# Altium project GEM_AFE_128.PrjPcb (part 2 of 4)

## Sheet DAC.SchDoc: DAC
size 420 x 297 mm; CheckedBy: K.Belewicz; DrawnBy: G.Kasprowicz; SheetNumber: 3; SheetTotal: 5; ModifiedBy: -; CheckedDate: 12.06.2022; Title2: GEM AFE 128; DivGrp: WUT ISE; Designer: G.Kasprowicz
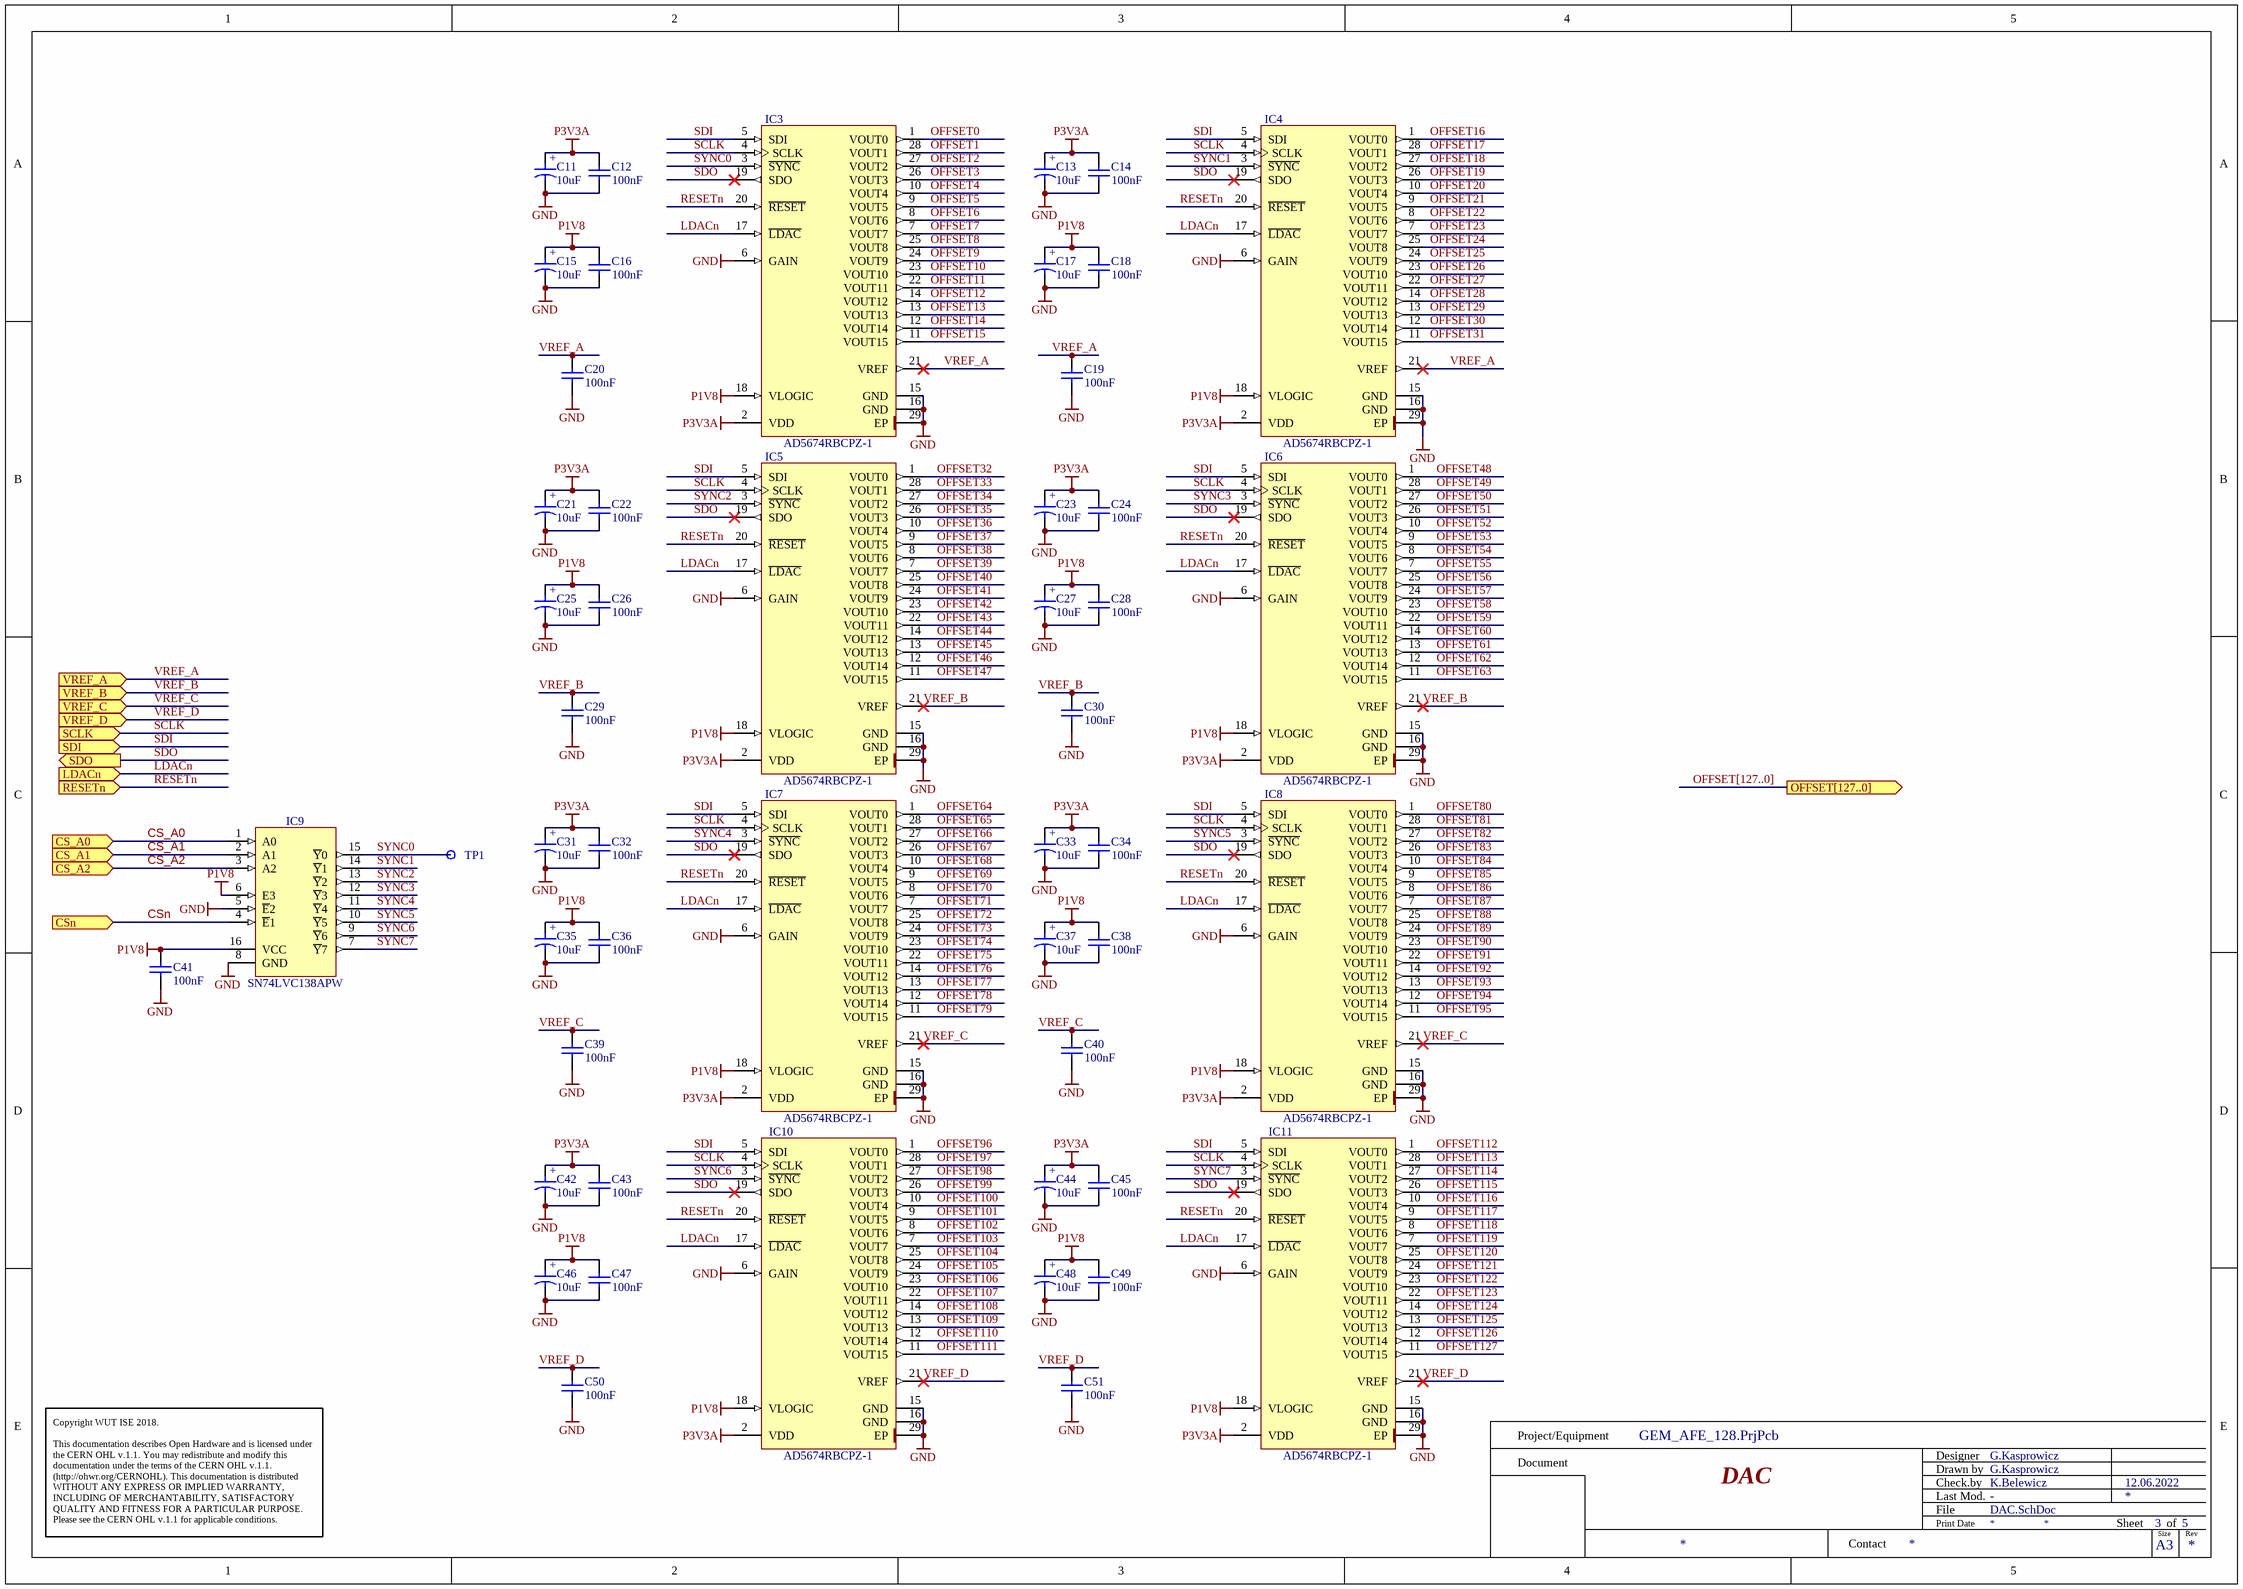
[diagram p2: DAC.SchDoc]

### Parts
C11  10uF  [CAPMP3216X180N]
C12  100nF  [CAPC1005X55N]
C13  10uF  [CAPMP3216X180N]
C14  100nF  [CAPC1005X55N]
C15  10uF  [CAPMP3216X180N]
C16  100nF  [CAPC1005X55N]
C17  10uF  [CAPMP3216X180N]
C18  100nF  [CAPC1005X55N]
C19  100nF  [CAPC1005X55N]
C20  100nF  [CAPC1005X55N]
C21  10uF  [CAPMP3216X180N]
C22  100nF  [CAPC1005X55N]
C23  10uF  [CAPMP3216X180N]
C24  100nF  [CAPC1005X55N]
C25  10uF  [CAPMP3216X180N]
C26  100nF  [CAPC1005X55N]
C27  10uF  [CAPMP3216X180N]
C28  100nF  [CAPC1005X55N]
C29  100nF  [CAPC1005X55N]
C30  100nF  [CAPC1005X55N]
C31  10uF  [CAPMP3216X180N]
C32  100nF  [CAPC1005X55N]
C33  10uF  [CAPMP3216X180N]
C34  100nF  [CAPC1005X55N]
C35  10uF  [CAPMP3216X180N]
C36  100nF  [CAPC1005X55N]
C37  10uF  [CAPMP3216X180N]
C38  100nF  [CAPC1005X55N]
C39  100nF  [CAPC1005X55N]
C40  100nF  [CAPC1005X55N]
C41  100nF  [CAPC1005X55N]
C42  10uF  [CAPMP3216X180N]
C43  100nF  [CAPC1005X55N]
C44  10uF  [CAPMP3216X180N]
C45  100nF  [CAPC1005X55N]
C46  10uF  [CAPMP3216X180N]
C47  100nF  [CAPC1005X55N]
C48  10uF  [CAPMP3216X180N]
C49  100nF  [CAPC1005X55N]
C50  100nF  [CAPC1005X55N]
C51  100nF  [CAPC1005X55N]
IC3  AD5674RBCPZ-1  [QFN40P400X400X100-29N-S270]
IC4  AD5674RBCPZ-1  [QFN40P400X400X100-29N-S270]
IC5  AD5674RBCPZ-1  [QFN40P400X400X100-29N-S270]
IC6  AD5674RBCPZ-1  [QFN40P400X400X100-29N-S270]
IC7  AD5674RBCPZ-1  [QFN40P400X400X100-29N-S270]
IC8  AD5674RBCPZ-1  [QFN40P400X400X100-29N-S270]
IC9  SN74LVC138APW  [SOP65P640X110-16N]
IC10  AD5674RBCPZ-1  [QFN40P400X400X100-29N-S270]
IC11  AD5674RBCPZ-1  [QFN40P400X400X100-29N-S270]
TP1  Test Point  [TPS127]  (value not drawn)

### Ports
CS_A0 (in), CS_A1 (in), CS_A2 (in), CSn (in), LDACn (in), OFFSET[127..0] (out), RESETn (in), SCLK (in), SDI (in), SDO (out), VREF_A (in), VREF_B (in), VREF_C (in), VREF_D (in)

### Nets
GND: C11.2 C12.1 C13.2 C14.1 C15.2 C16.1 C17.2 C18.1 C19.1 C20.1 C21.2 C22.1 C23.2 C24.1 C25.2 C26.1 C27.2 C28.1 C29.1 C30.1 C31.2 C32.1 C33.2 C34.1 C35.2 C36.1 C37.2 C38.1 C39.1 C40.1 C41.1 C42.2 C43.1 C44.2 C45.1 C46.2 C47.1 C48.2 C49.1 C50.1 C51.1 IC3.6(GAIN) IC3.15(GND) IC3.16(GND) IC3.29(EP) IC4.6(GAIN) IC4.15(GND) IC4.16(GND) IC4.29(EP) IC5.6(GAIN) IC5.15(GND) IC5.16(GND) IC5.29(EP) IC6.6(GAIN) IC6.15(GND) IC6.16(GND) IC6.29(EP) IC7.6(GAIN) IC7.15(GND) IC7.16(GND) IC7.29(EP) IC8.6(GAIN) IC8.15(GND) IC8.16(GND) IC8.29(EP) IC9.5(~{E}2) IC9.8(GND) IC10.6(GAIN) IC10.15(GND) IC10.16(GND) IC10.29(EP) IC11.6(GAIN) IC11.15(GND) IC11.16(GND) IC11.29(EP)
P1V8: C15.1 C16.2 C17.1 C18.2 C25.1 C26.2 C27.1 C28.2 C35.1 C36.2 C37.1 C38.2 C41.2 C46.1 C47.2 C48.1 C49.2 IC3.18(VLOGIC) IC4.18(VLOGIC) IC5.18(VLOGIC) IC6.18(VLOGIC) IC7.18(VLOGIC) IC8.18(VLOGIC) IC9.6(E3) IC9.16(VCC) IC10.18(VLOGIC) IC11.18(VLOGIC)
P3V3A: C11.1 C12.2 C13.1 C14.2 C21.1 C22.2 C23.1 C24.2 C31.1 C32.2 C33.1 C34.2 C42.1 C43.2 C44.1 C45.2 IC3.2(VDD) IC4.2(VDD) IC5.2(VDD) IC6.2(VDD) IC7.2(VDD) IC8.2(VDD) IC10.2(VDD) IC11.2(VDD)
CS_A0: IC9.1(A0) ; port CS_A0
CS_A1: IC9.2(A1) ; port CS_A1
CS_A2: IC9.3(A2) ; port CS_A2
CSn: IC9.4(~{E}1) ; port CSn
LDACn: IC3.17(~{LDAC}) IC4.17(~{LDAC}) IC5.17(~{LDAC}) IC6.17(~{LDAC}) IC7.17(~{LDAC}) IC8.17(~{LDAC}) IC10.17(~{LDAC}) IC11.17(~{LDAC}) ; port LDACn  [project net DAC_LDACn]
OFFSET0: IC3.1(VOUT0)
OFFSET1: IC3.28(VOUT1)
OFFSET2: IC3.27(VOUT2)
OFFSET3: IC3.26(VOUT3)
OFFSET4: IC3.10(VOUT4)
OFFSET5: IC3.9(VOUT5)
OFFSET6: IC3.8(VOUT6)
OFFSET7: IC3.7(VOUT7)
OFFSET8: IC3.25(VOUT8)
OFFSET9: IC3.24(VOUT9)
OFFSET10: IC3.23(VOUT10)
OFFSET11: IC3.22(VOUT11)
OFFSET12: IC3.14(VOUT12)
OFFSET13: IC3.13(VOUT13)
OFFSET14: IC3.12(VOUT14)
OFFSET15: IC3.11(VOUT15)
OFFSET16: IC4.1(VOUT0)
OFFSET17: IC4.28(VOUT1)
OFFSET18: IC4.27(VOUT2)
OFFSET19: IC4.26(VOUT3)
OFFSET20: IC4.10(VOUT4)
OFFSET21: IC4.9(VOUT5)
OFFSET22: IC4.8(VOUT6)
OFFSET23: IC4.7(VOUT7)
OFFSET24: IC4.25(VOUT8)
OFFSET25: IC4.24(VOUT9)
OFFSET26: IC4.23(VOUT10)
OFFSET27: IC4.22(VOUT11)
OFFSET28: IC4.14(VOUT12)
OFFSET29: IC4.13(VOUT13)
OFFSET30: IC4.12(VOUT14)
OFFSET31: IC4.11(VOUT15)
OFFSET32: IC5.1(VOUT0)
OFFSET33: IC5.28(VOUT1)
OFFSET34: IC5.27(VOUT2)
OFFSET35: IC5.26(VOUT3)
OFFSET36: IC5.10(VOUT4)
OFFSET37: IC5.9(VOUT5)
OFFSET38: IC5.8(VOUT6)
OFFSET39: IC5.7(VOUT7)
OFFSET40: IC5.25(VOUT8)
OFFSET41: IC5.24(VOUT9)
OFFSET42: IC5.23(VOUT10)
OFFSET43: IC5.22(VOUT11)
OFFSET44: IC5.14(VOUT12)
OFFSET45: IC5.13(VOUT13)
OFFSET46: IC5.12(VOUT14)
OFFSET47: IC5.11(VOUT15)
OFFSET48: IC6.1(VOUT0)
OFFSET49: IC6.28(VOUT1)
OFFSET50: IC6.27(VOUT2)
OFFSET51: IC6.26(VOUT3)
OFFSET52: IC6.10(VOUT4)
OFFSET53: IC6.9(VOUT5)
OFFSET54: IC6.8(VOUT6)
OFFSET55: IC6.7(VOUT7)
OFFSET56: IC6.25(VOUT8)
OFFSET57: IC6.24(VOUT9)
OFFSET58: IC6.23(VOUT10)
OFFSET59: IC6.22(VOUT11)
OFFSET60: IC6.14(VOUT12)
OFFSET61: IC6.13(VOUT13)
OFFSET62: IC6.12(VOUT14)
OFFSET63: IC6.11(VOUT15)
OFFSET64: IC7.1(VOUT0)
OFFSET65: IC7.28(VOUT1)
OFFSET66: IC7.27(VOUT2)
OFFSET67: IC7.26(VOUT3)
OFFSET68: IC7.10(VOUT4)
OFFSET69: IC7.9(VOUT5)
OFFSET70: IC7.8(VOUT6)
OFFSET71: IC7.7(VOUT7)
OFFSET72: IC7.25(VOUT8)
OFFSET73: IC7.24(VOUT9)
OFFSET74: IC7.23(VOUT10)
OFFSET75: IC7.22(VOUT11)
OFFSET76: IC7.14(VOUT12)
OFFSET77: IC7.13(VOUT13)
OFFSET78: IC7.12(VOUT14)
OFFSET79: IC7.11(VOUT15)
OFFSET80: IC8.1(VOUT0)
OFFSET81: IC8.28(VOUT1)
OFFSET82: IC8.27(VOUT2)
OFFSET83: IC8.26(VOUT3)
OFFSET84: IC8.10(VOUT4)
OFFSET85: IC8.9(VOUT5)
OFFSET86: IC8.8(VOUT6)
OFFSET87: IC8.7(VOUT7)
OFFSET88: IC8.25(VOUT8)
OFFSET89: IC8.24(VOUT9)
OFFSET90: IC8.23(VOUT10)
OFFSET91: IC8.22(VOUT11)
OFFSET92: IC8.14(VOUT12)
OFFSET93: IC8.13(VOUT13)
OFFSET94: IC8.12(VOUT14)
OFFSET95: IC8.11(VOUT15)
OFFSET96: IC10.1(VOUT0)
OFFSET97: IC10.28(VOUT1)
OFFSET98: IC10.27(VOUT2)
OFFSET99: IC10.26(VOUT3)
OFFSET100: IC10.10(VOUT4)
OFFSET101: IC10.9(VOUT5)
OFFSET102: IC10.8(VOUT6)
OFFSET103: IC10.7(VOUT7)
OFFSET104: IC10.25(VOUT8)
OFFSET105: IC10.24(VOUT9)
OFFSET106: IC10.23(VOUT10)
OFFSET107: IC10.22(VOUT11)
OFFSET108: IC10.14(VOUT12)
OFFSET109: IC10.13(VOUT13)
OFFSET110: IC10.12(VOUT14)
OFFSET111: IC10.11(VOUT15)
OFFSET112: IC11.1(VOUT0)
OFFSET113: IC11.28(VOUT1)
OFFSET114: IC11.27(VOUT2)
OFFSET115: IC11.26(VOUT3)
OFFSET116: IC11.10(VOUT4)
OFFSET117: IC11.9(VOUT5)
OFFSET118: IC11.8(VOUT6)
OFFSET119: IC11.7(VOUT7)
OFFSET120: IC11.25(VOUT8)
OFFSET121: IC11.24(VOUT9)
OFFSET122: IC11.23(VOUT10)
OFFSET123: IC11.22(VOUT11)
OFFSET124: IC11.14(VOUT12)
OFFSET125: IC11.13(VOUT13)
OFFSET126: IC11.12(VOUT14)
OFFSET127: IC11.11(VOUT15)
RESETn: IC3.20(~{RESET}) IC4.20(~{RESET}) IC5.20(~{RESET}) IC6.20(~{RESET}) IC7.20(~{RESET}) IC8.20(~{RESET}) IC10.20(~{RESET}) IC11.20(~{RESET}) ; port RESETn  [project net DAC_RESETn]
SCLK: IC3.4(SCLK) IC4.4(SCLK) IC5.4(SCLK) IC6.4(SCLK) IC7.4(SCLK) IC8.4(SCLK) IC10.4(SCLK) IC11.4(SCLK) ; port SCLK  [project net DAC_SCLK]
SDI: IC3.5(SDI) IC4.5(SDI) IC5.5(SDI) IC6.5(SDI) IC7.5(SDI) IC8.5(SDI) IC10.5(SDI) IC11.5(SDI) ; port SDI  [project net DAC_SDI]
SDO: IC3.19(SDO) IC4.19(SDO) IC5.19(SDO) IC6.19(SDO) IC7.19(SDO) IC8.19(SDO) IC10.19(SDO) IC11.19(SDO) ; port SDO  [project net DAC_SDO]
SYNC0: IC3.3(~{SYNC}) IC9.15(~{Y}0) TP1.1
SYNC1: IC4.3(~{SYNC}) IC9.14(~{Y}1)
SYNC2: IC5.3(~{SYNC}) IC9.13(~{Y}2)
SYNC3: IC6.3(~{SYNC}) IC9.12(~{Y}3)
SYNC4: IC7.3(~{SYNC}) IC9.11(~{Y}4)
SYNC5: IC8.3(~{SYNC}) IC9.10(~{Y}5)
SYNC6: IC9.9(~{Y}6) IC10.3(~{SYNC})
SYNC7: IC9.7(~{Y}7) IC11.3(~{SYNC})
VREF_A: C19.2 C20.2 IC3.21(VREF) IC4.21(VREF) ; port VREF_A
VREF_B: C29.2 C30.2 IC5.21(VREF) IC6.21(VREF) ; port VREF_B
VREF_C: C39.2 C40.2 IC7.21(VREF) IC8.21(VREF) ; port VREF_C
VREF_D: C50.2 C51.2 IC10.21(VREF) IC11.21(VREF) ; port VREF_D

### Buses and harness runs
bus OFFSET[127..0] = port OFFSET[127..0]

### Notes on the sheet
- Project/Equipment
- Document
- Designer
- Drawn by
- Check.by
- Copyright WUT ISE 2018.
  This documentation describes Open Hardware and is licensed under the CERN OHL v.1.1. You may redistribute and modify this documentation under the terms of the CERN OHL v.1.1. (http://ohwr.org/CERNOHL). This documentation is distributed WITHOUT ANY EXPRESS OR IMPLIED WARRANTY, INCLUDING OF MERCHANTABILITY, SATISFACTORY QUALITY AND FITNESS FOR A PARTICULAR PURPOSE. Please see the CERN OHL v.1.1 for applicable conditions.
- Contact
- File
- Last Mod.
- Print Date
- Sheet
- Size
- A3
- of
- Rev
- (in symbol CTE3216-18_10UF_16V_20%_AVX_TCJ) +

### Library data of the parts
C11 C13 C15 C17 C21 C23 C25 C27 C31 C33 C35 C37 C42 C44 C46 C48 = CTE3216-18_10UF_16V_20%_AVX_TCJ: Polarised capacitor; Part Description: ESR 0R200 Tantalum Solid Electrolytic Chip Capacitor with Conductive Polymer Electrode; Manufacturer: AVX; Manufacturer Part Number: TCJA106M016R0200; Voltage: 16V; Tolerance: ±20%; Part Number: CTE3216-18_10UF_16V_20%_AVX_TCJ; Component Kind: Standard; Component Type: Standard; Pin Count: 2; Value: 10uF; Status: Preferred; Case: A; Mounted: Yes; Socket: No; SMD: Yes; Sense: No; ComponentHeight: 1.8mm; HelpURL: \\cern.ch\dfs\Applications\Altium\Datasheets\CTE_AVX_TCJ.pdf; Author: CERN DEM JLC; CreateDate: 29.03.2012; LatestRevisionDate: 29.03.2012
C12 C14 C16 C18-C20 C22 C24 C26 C28-C30 C32 C34 C36 C38-C40 C43 C45 C47 C49-C51 = CC0402_100NF_6.3V_10%_X7R: Non-polarised capacitor; Part Description: SMD Multilayer Chip Ceramic Capacitor; Manufacturer: GENERIC; Manufacturer1 Part Number: GRM155R70J104KA01D; Voltage: 6.3V; TC: X7R; Tolerance: ±10%; Part Number: CC0402_100NF_6.3V_10%_X7R; Component Kind: Standard; Component Type: Standard; Pin Count: 2; Value: 100nF; Status: Not Recommended; Manufacturer Part Number: CC0402_100NF_6.3V_10%_X7R; Case: 0402; Mounted: Yes; Socket: No; SMD: Yes; Sense: No; Manufacturer1 Example: MURATA; Manufacturer1 ComponentHeight: 0.55mm; HelpURL: \\cern.ch\dfs\Applications\Altium\Datasheets\CC0402_X7R_MURATA_GRM.pdf; Author: CERN DEM BC; CreateDate: 02.11.2015; LatestRevisionDate: 02.11.2015
C41 = CC0402_100NF_16V_10%_X5R: Non-polarised capacitor; Part Description: SMD Multilayer Chip Ceramic Capacitor; Manufacturer: GENERIC; Manufacturer1 Part Number: GRM155R61C104KA88D; Voltage: 16V; TC: X5R; Tolerance: ±10%; Part Number: CC0402_100NF_16V_10%_X5R; Component Kind: Standard; Component Type: Standard; Pin Count: 2; Value: 100nF; Status: None; Manufacturer Part Number: CC0402_100NF_16V_10%_X5R; Case: 0402; Mounted: Yes; Socket: No; SMD: Yes; Sense: No; Manufacturer1 Example: MURATA; Manufacturer1 ComponentHeight: 0.55mm; HelpURL: \\cern.ch\dfs\Applications\Altium\Datasheets\CC0402_X5R_MURATA_GRM.pdf; Author: CERN DEM JLC; CreateDate: 10.12.2013; LatestRevisionDate: 10.12.2013
IC3-IC8 IC10 IC11 = AD5674RBCPZ-1: 12-Bit nanoDAC+ with 2 ppm/°C Voltage Reference Temperature Coefficient, SPI Interface; Manufacturer: ANALOG DEVICES; PressFit: No; Bonding: No; Part Number: AD5674RBCPZ-1; Component Kind: Standard; Component Type: Standard; Device: AD5674RBCPZ-1; PackageDescription: QFN, 0.40mm Pitch, Square; 28 Pin, 4.00mm L X 4.00mm W X 1.00mm H body (w/Thermal Tab 2.70 X 2.70mm), IPC Medium Density; Part Description: 12-Bit nanoDAC+ with 2 ppm/°C Voltage Reference Temperature Coefficient, SPI Interface; Manufacturer Part Number: AD5674RBCPZ-1; Pin Count: 28; Case: QFN28; Mounted: Yes; Socket: No; SMD: Yes; Sense: No; ComponentHeight: 1.0mm; Author: CERN DEM HF; HelpURL: \\cern.ch\dfs\Applications\Altium\Datasheets\AD5674RBCPZ-1.pdf; CreateDate: 19.04.2022; LatestRevisionDate: 19.04.2022
IC9 = SN74LVC138APW: 3-Line to 8-Line Decoder/Demultiplexer; Part Description: 3-Line to 8-Line Decoder/Demultiplexer, Inverting; Manufacturer: Texas Instruments; PressFit: No; Bonding: No; Part Number: SN74LVC138APW; Component Kind: Standard; Component Type: Standard; Device: SN74LVC138APW; PackageDescription: SOP, 0.65mm pitch; 16 pin, 4.40mm W X 5.00mm L X 1.10mm H body IPC Medium Density; Manufacturer Part Number: SN74LVC138APW; Pin Count: 16; Case: TSSOP16; Mounted: Yes; Socket: No; SMD: Yes; Sense: No; ComponentHeight: 1.1mm; Author: GK; HelpURL: \\cern.ch\dfs\Applications\Altium\Datasheets\74HC138PW.pdf; CreateDate: 09/06/2015; LatestRevisionDate: 09/06/2015
TP1 = SMD_PAD_1.27X1.27MM: Part Description: 1.27mm x 1.27mm PCB Copper Area (SMD Test Point); Mounted: No; Part Number: SMD_PAD_1.27X1.27MM; Component Kind: Standard (No BOM); Component Type: Standard (No BOM); Pin Count: 1; Family: Test Point; Socket: No; SMD: Yes; Sense: No; Status: None; ComponentHeight: 0mm; HelpURL: Undefined; Author: CERN DEM JLC; CreateDate: 12.01.2008; LatestRevisionDate: 12.01.2008; PackageDescription: 1.27mm x 1.27mm PCB Copper Area (SMD Test Point)

## Sheet CAL_logics.SchDoc: Calibration logics
size 420 x 297 mm; CheckedBy: K.Belewicz; DrawnBy: G.Kasprowicz; SheetNumber: 2; SheetTotal: 5; ModifiedBy: -; CheckedDate: 12.06.2022; Title2: GEM AFE 128; DivGrp: WUT ISE; Designer: G.Kasprowicz
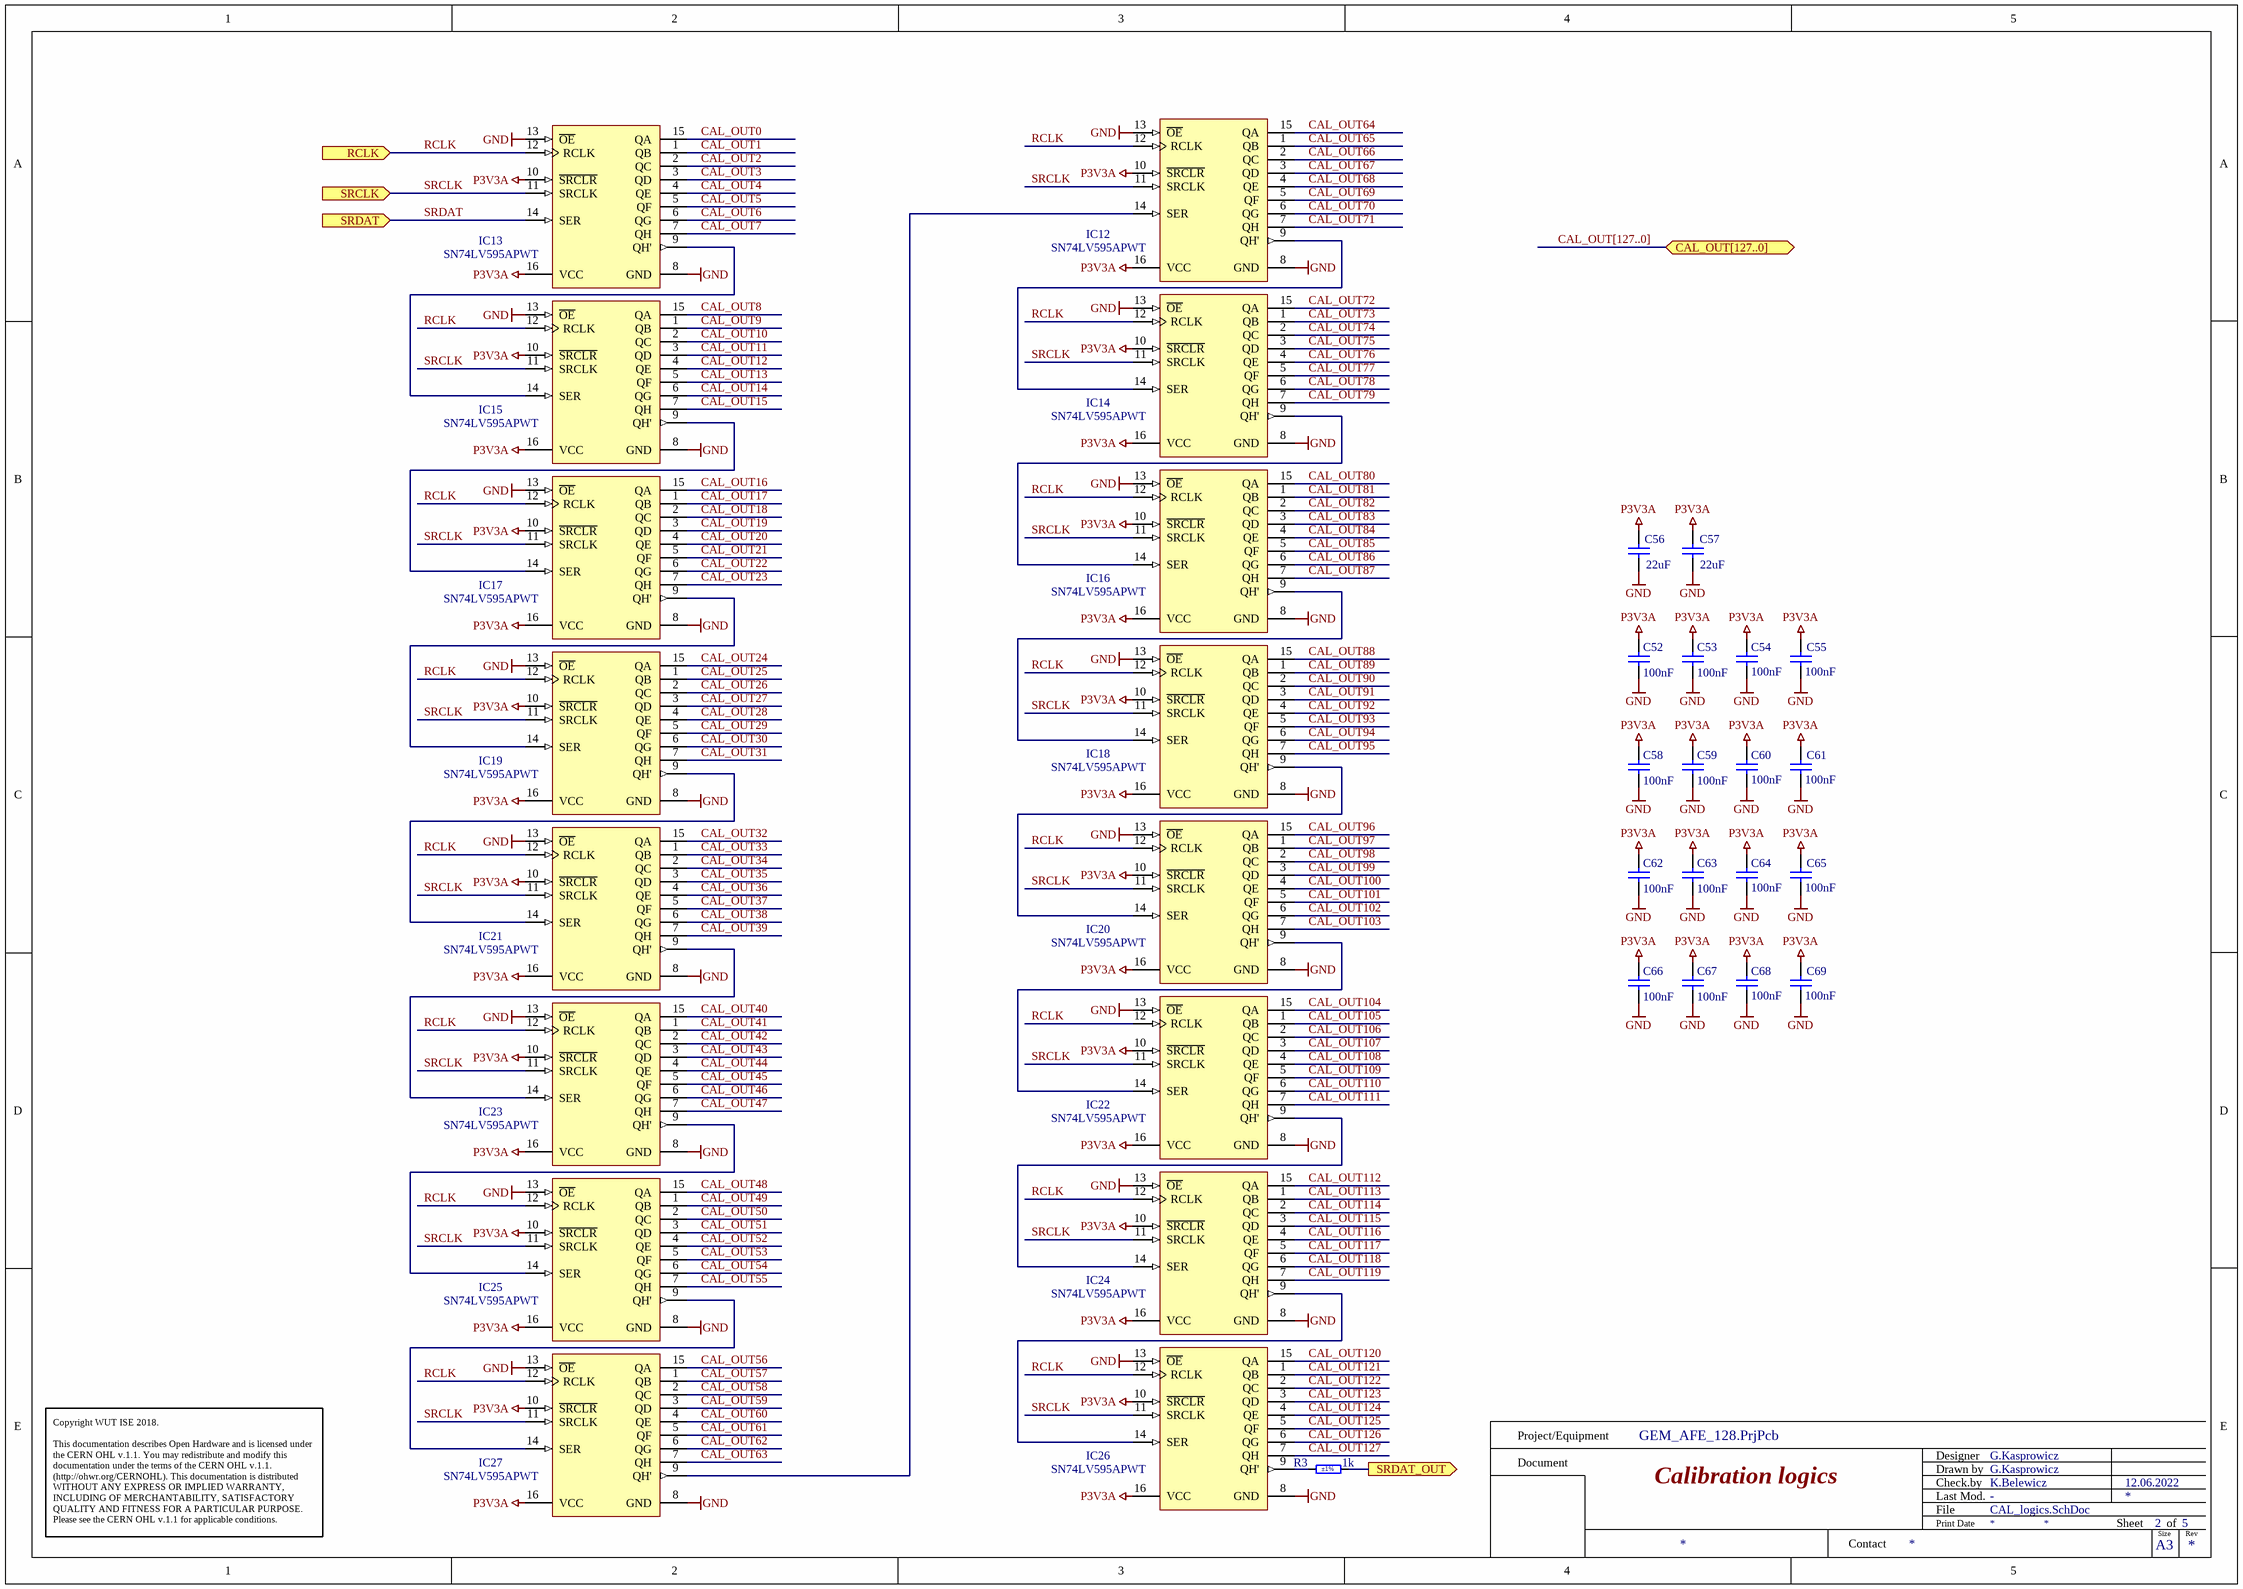
[diagram p3: CAL_logics.SchDoc]

### Parts
C52  100nF  [CAPC1005X55N]
C53  100nF  [CAPC1005X55N]
C54  100nF  [CAPC1005X55N]
C55  100nF  [CAPC1005X55N]
C56  22uF  [CAPC3216X140N]
C57  22uF  [CAPC3216X140N]
C58  100nF  [CAPC1005X55N]
C59  100nF  [CAPC1005X55N]
C60  100nF  [CAPC1005X55N]
C61  100nF  [CAPC1005X55N]
C62  100nF  [CAPC1005X55N]
C63  100nF  [CAPC1005X55N]
C64  100nF  [CAPC1005X55N]
C65  100nF  [CAPC1005X55N]
C66  100nF  [CAPC1005X55N]
C67  100nF  [CAPC1005X55N]
C68  100nF  [CAPC1005X55N]
C69  100nF  [CAPC1005X55N]
IC12  SN74LV595APWT  [SOP65P640X120-16N]
IC13  SN74LV595APWT  [SOP65P640X120-16N]
IC14  SN74LV595APWT  [SOP65P640X120-16N]
IC15  SN74LV595APWT  [SOP65P640X120-16N]
IC16  SN74LV595APWT  [SOP65P640X120-16N]
IC17  SN74LV595APWT  [SOP65P640X120-16N]
IC18  SN74LV595APWT  [SOP65P640X120-16N]
IC19  SN74LV595APWT  [SOP65P640X120-16N]
IC20  SN74LV595APWT  [SOP65P640X120-16N]
IC21  SN74LV595APWT  [SOP65P640X120-16N]
IC22  SN74LV595APWT  [SOP65P640X120-16N]
IC23  SN74LV595APWT  [SOP65P640X120-16N]
IC24  SN74LV595APWT  [SOP65P640X120-16N]
IC25  SN74LV595APWT  [SOP65P640X120-16N]
IC26  SN74LV595APWT  [SOP65P640X120-16N]
IC27  SN74LV595APWT  [SOP65P640X120-16N]
R3  1k  Tolerance: ±1%  [RESC1005X40N]

### Ports
CAL_OUT[127..0] (bidir), RCLK (in), SRCLK (in), SRDAT (in), SRDAT_OUT (out)

### Nets
GND: C52.1 C53.1 C54.1 C55.1 C56.1 C57.1 C58.1 C59.1 C60.1 C61.1 C62.1 C63.1 C64.1 C65.1 C66.1 C67.1 C68.1 C69.1 IC12.8(GND) IC12.13(~{OE}) IC13.8(GND) IC13.13(~{OE}) IC14.8(GND) IC14.13(~{OE}) IC15.8(GND) IC15.13(~{OE}) IC16.8(GND) IC16.13(~{OE}) IC17.8(GND) IC17.13(~{OE}) IC18.8(GND) IC18.13(~{OE}) IC19.8(GND) IC19.13(~{OE}) IC20.8(GND) IC20.13(~{OE}) IC21.8(GND) IC21.13(~{OE}) IC22.8(GND) IC22.13(~{OE}) IC23.8(GND) IC23.13(~{OE}) IC24.8(GND) IC24.13(~{OE}) IC25.8(GND) IC25.13(~{OE}) IC26.8(GND) IC26.13(~{OE}) IC27.8(GND) IC27.13(~{OE})
P3V3A: C52.2 C53.2 C54.2 C55.2 C56.2 C57.2 C58.2 C59.2 C60.2 C61.2 C62.2 C63.2 C64.2 C65.2 C66.2 C67.2 C68.2 C69.2 IC12.10(~{SRCLR}) IC12.16(VCC) IC13.10(~{SRCLR}) IC13.16(VCC) IC14.10(~{SRCLR}) IC14.16(VCC) IC15.10(~{SRCLR}) IC15.16(VCC) IC16.10(~{SRCLR}) IC16.16(VCC) IC17.10(~{SRCLR}) IC17.16(VCC) IC18.10(~{SRCLR}) IC18.16(VCC) IC19.10(~{SRCLR}) IC19.16(VCC) IC20.10(~{SRCLR}) IC20.16(VCC) IC21.10(~{SRCLR}) IC21.16(VCC) IC22.10(~{SRCLR}) IC22.16(VCC) IC23.10(~{SRCLR}) IC23.16(VCC) IC24.10(~{SRCLR}) IC24.16(VCC) IC25.10(~{SRCLR}) IC25.16(VCC) IC26.10(~{SRCLR}) IC26.16(VCC) IC27.10(~{SRCLR}) IC27.16(VCC)
CAL_OUT0: IC13.15(QA)  [project net CAL_IN0]
CAL_OUT1: IC13.1(QB)  [project net CAL_IN1]
CAL_OUT2: IC13.2(QC)  [project net CAL_IN2]
CAL_OUT3: IC13.3(QD)  [project net CAL_IN3]
CAL_OUT4: IC13.4(QE)  [project net CAL_IN4]
CAL_OUT5: IC13.5(QF)  [project net CAL_IN5]
CAL_OUT6: IC13.6(QG)  [project net CAL_IN6]
CAL_OUT7: IC13.7(QH)  [project net CAL_IN7]
CAL_OUT8: IC15.15(QA)  [project net CAL_IN8]
CAL_OUT9: IC15.1(QB)  [project net CAL_IN9]
CAL_OUT10: IC15.2(QC)  [project net CAL_IN10]
CAL_OUT11: IC15.3(QD)  [project net CAL_IN11]
CAL_OUT12: IC15.4(QE)  [project net CAL_IN12]
CAL_OUT13: IC15.5(QF)  [project net CAL_IN13]
CAL_OUT14: IC15.6(QG)  [project net CAL_IN14]
CAL_OUT15: IC15.7(QH)  [project net CAL_IN15]
CAL_OUT16: IC17.15(QA)  [project net CAL_IN16]
CAL_OUT17: IC17.1(QB)  [project net CAL_IN17]
CAL_OUT18: IC17.2(QC)  [project net CAL_IN18]
CAL_OUT19: IC17.3(QD)  [project net CAL_IN19]
CAL_OUT20: IC17.4(QE)  [project net CAL_IN20]
CAL_OUT21: IC17.5(QF)  [project net CAL_IN21]
CAL_OUT22: IC17.6(QG)  [project net CAL_IN22]
CAL_OUT23: IC17.7(QH)  [project net CAL_IN23]
CAL_OUT24: IC19.15(QA)  [project net CAL_IN24]
CAL_OUT25: IC19.1(QB)  [project net CAL_IN25]
CAL_OUT26: IC19.2(QC)  [project net CAL_IN26]
CAL_OUT27: IC19.3(QD)  [project net CAL_IN27]
CAL_OUT28: IC19.4(QE)  [project net CAL_IN28]
CAL_OUT29: IC19.5(QF)  [project net CAL_IN29]
CAL_OUT30: IC19.6(QG)  [project net CAL_IN30]
CAL_OUT31: IC19.7(QH)  [project net CAL_IN31]
CAL_OUT32: IC21.15(QA)  [project net CAL_IN32]
CAL_OUT33: IC21.1(QB)  [project net CAL_IN33]
CAL_OUT34: IC21.2(QC)  [project net CAL_IN34]
CAL_OUT35: IC21.3(QD)  [project net CAL_IN35]
CAL_OUT36: IC21.4(QE)  [project net CAL_IN36]
CAL_OUT37: IC21.5(QF)  [project net CAL_IN37]
CAL_OUT38: IC21.6(QG)  [project net CAL_IN38]
CAL_OUT39: IC21.7(QH)  [project net CAL_IN39]
CAL_OUT40: IC23.15(QA)  [project net CAL_IN40]
CAL_OUT41: IC23.1(QB)  [project net CAL_IN41]
CAL_OUT42: IC23.2(QC)  [project net CAL_IN42]
CAL_OUT43: IC23.3(QD)  [project net CAL_IN43]
CAL_OUT44: IC23.4(QE)  [project net CAL_IN44]
CAL_OUT45: IC23.5(QF)  [project net CAL_IN45]
CAL_OUT46: IC23.6(QG)  [project net CAL_IN46]
CAL_OUT47: IC23.7(QH)  [project net CAL_IN47]
CAL_OUT48: IC25.15(QA)  [project net CAL_IN48]
CAL_OUT49: IC25.1(QB)  [project net CAL_IN49]
CAL_OUT50: IC25.2(QC)  [project net CAL_IN50]
CAL_OUT51: IC25.3(QD)  [project net CAL_IN51]
CAL_OUT52: IC25.4(QE)  [project net CAL_IN52]
CAL_OUT53: IC25.5(QF)  [project net CAL_IN53]
CAL_OUT54: IC25.6(QG)  [project net CAL_IN54]
CAL_OUT55: IC25.7(QH)  [project net CAL_IN55]
CAL_OUT56: IC27.15(QA)  [project net CAL_IN56]
CAL_OUT57: IC27.1(QB)  [project net CAL_IN57]
CAL_OUT58: IC27.2(QC)  [project net CAL_IN58]
CAL_OUT59: IC27.3(QD)  [project net CAL_IN59]
CAL_OUT60: IC27.4(QE)  [project net CAL_IN60]
CAL_OUT61: IC27.5(QF)  [project net CAL_IN61]
CAL_OUT62: IC27.6(QG)  [project net CAL_IN62]
CAL_OUT63: IC27.7(QH)  [project net CAL_IN63]
CAL_OUT64: IC12.15(QA)  [project net CAL_IN64]
CAL_OUT65: IC12.1(QB)  [project net CAL_IN65]
CAL_OUT66: IC12.2(QC)  [project net CAL_IN66]
CAL_OUT67: IC12.3(QD)  [project net CAL_IN67]
CAL_OUT68: IC12.4(QE)  [project net CAL_IN68]
CAL_OUT69: IC12.5(QF)  [project net CAL_IN69]
CAL_OUT70: IC12.6(QG)  [project net CAL_IN70]
CAL_OUT71: IC12.7(QH)  [project net CAL_IN71]
CAL_OUT72: IC14.15(QA)  [project net CAL_IN72]
CAL_OUT73: IC14.1(QB)  [project net CAL_IN73]
CAL_OUT74: IC14.2(QC)  [project net CAL_IN74]
CAL_OUT75: IC14.3(QD)  [project net CAL_IN75]
CAL_OUT76: IC14.4(QE)  [project net CAL_IN76]
CAL_OUT77: IC14.5(QF)  [project net CAL_IN77]
CAL_OUT78: IC14.6(QG)  [project net CAL_IN78]
CAL_OUT79: IC14.7(QH)  [project net CAL_IN79]
CAL_OUT80: IC16.15(QA)  [project net CAL_IN80]
CAL_OUT81: IC16.1(QB)  [project net CAL_IN81]
CAL_OUT82: IC16.2(QC)  [project net CAL_IN82]
CAL_OUT83: IC16.3(QD)  [project net CAL_IN83]
CAL_OUT84: IC16.4(QE)  [project net CAL_IN84]
CAL_OUT85: IC16.5(QF)  [project net CAL_IN85]
CAL_OUT86: IC16.6(QG)  [project net CAL_IN86]
CAL_OUT87: IC16.7(QH)  [project net CAL_IN87]
CAL_OUT88: IC18.15(QA)  [project net CAL_IN88]
CAL_OUT89: IC18.1(QB)  [project net CAL_IN89]
CAL_OUT90: IC18.2(QC)  [project net CAL_IN90]
CAL_OUT91: IC18.3(QD)  [project net CAL_IN91]
CAL_OUT92: IC18.4(QE)  [project net CAL_IN92]
CAL_OUT93: IC18.5(QF)  [project net CAL_IN93]
CAL_OUT94: IC18.6(QG)  [project net CAL_IN94]
CAL_OUT95: IC18.7(QH)  [project net CAL_IN95]
CAL_OUT96: IC20.15(QA)  [project net CAL_IN96]
CAL_OUT97: IC20.1(QB)  [project net CAL_IN97]
CAL_OUT98: IC20.2(QC)  [project net CAL_IN98]
CAL_OUT99: IC20.3(QD)  [project net CAL_IN99]
CAL_OUT100: IC20.4(QE)  [project net CAL_IN100]
CAL_OUT101: IC20.5(QF)  [project net CAL_IN101]
CAL_OUT102: IC20.6(QG)  [project net CAL_IN102]
CAL_OUT103: IC20.7(QH)  [project net CAL_IN103]
CAL_OUT104: IC22.15(QA)  [project net CAL_IN104]
CAL_OUT105: IC22.1(QB)  [project net CAL_IN105]
CAL_OUT106: IC22.2(QC)  [project net CAL_IN106]
CAL_OUT107: IC22.3(QD)  [project net CAL_IN107]
CAL_OUT108: IC22.4(QE)  [project net CAL_IN108]
CAL_OUT109: IC22.5(QF)  [project net CAL_IN109]
CAL_OUT110: IC22.6(QG)  [project net CAL_IN110]
CAL_OUT111: IC22.7(QH)  [project net CAL_IN111]
CAL_OUT112: IC24.15(QA)  [project net CAL_IN112]
CAL_OUT113: IC24.1(QB)  [project net CAL_IN113]
CAL_OUT114: IC24.2(QC)  [project net CAL_IN114]
CAL_OUT115: IC24.3(QD)  [project net CAL_IN115]
CAL_OUT116: IC24.4(QE)  [project net CAL_IN116]
CAL_OUT117: IC24.5(QF)  [project net CAL_IN117]
CAL_OUT118: IC24.6(QG)  [project net CAL_IN118]
CAL_OUT119: IC24.7(QH)  [project net CAL_IN119]
CAL_OUT120: IC26.15(QA)  [project net CAL_IN120]
CAL_OUT121: IC26.1(QB)  [project net CAL_IN121]
CAL_OUT122: IC26.2(QC)  [project net CAL_IN122]
CAL_OUT123: IC26.3(QD)  [project net CAL_IN123]
CAL_OUT124: IC26.4(QE)  [project net CAL_IN124]
CAL_OUT125: IC26.5(QF)  [project net CAL_IN125]
CAL_OUT126: IC26.6(QG)  [project net CAL_IN126]
CAL_OUT127: IC26.7(QH)  [project net CAL_IN127]
CAL_SRDAT_OUT: R3.2 ; port SRDAT_OUT
RCLK: IC12.12(RCLK) IC13.12(RCLK) IC14.12(RCLK) IC15.12(RCLK) IC16.12(RCLK) IC17.12(RCLK) IC18.12(RCLK) IC19.12(RCLK) IC20.12(RCLK) IC21.12(RCLK) IC22.12(RCLK) IC23.12(RCLK) IC24.12(RCLK) IC25.12(RCLK) IC26.12(RCLK) IC27.12(RCLK) ; port RCLK
SRCLK: IC12.11(SRCLK) IC13.11(SRCLK) IC14.11(SRCLK) IC15.11(SRCLK) IC16.11(SRCLK) IC17.11(SRCLK) IC18.11(SRCLK) IC19.11(SRCLK) IC20.11(SRCLK) IC21.11(SRCLK) IC22.11(SRCLK) IC23.11(SRCLK) IC24.11(SRCLK) IC25.11(SRCLK) IC26.11(SRCLK) IC27.11(SRCLK) ; port SRCLK  [project net CAL_SRCLK]
SRDAT: IC13.14(SER) ; port SRDAT  [project net CAL_SRDAT]
NetIC12_9: IC12.9(QH') IC14.14(SER)
NetIC12_14: IC12.14(SER) IC27.9(QH')
NetIC13_9: IC13.9(QH') IC15.14(SER)
NetIC14_9: IC14.9(QH') IC16.14(SER)
NetIC15_9: IC15.9(QH') IC17.14(SER)
NetIC16_9: IC16.9(QH') IC18.14(SER)
NetIC17_9: IC17.9(QH') IC19.14(SER)
NetIC18_9: IC18.9(QH') IC20.14(SER)
NetIC19_9: IC19.9(QH') IC21.14(SER)
NetIC20_9: IC20.9(QH') IC22.14(SER)
NetIC21_9: IC21.9(QH') IC23.14(SER)
NetIC22_9: IC22.9(QH') IC24.14(SER)
NetIC23_9: IC23.9(QH') IC25.14(SER)
NetIC24_9: IC24.9(QH') IC26.14(SER)
NetIC25_9: IC25.9(QH') IC27.14(SER)
NetIC26_9: IC26.9(QH') R3.1

### Buses and harness runs
bus CAL_OUT[127..0] = port CAL_OUT[127..0]

### Notes on the sheet
- Project/Equipment
- Document
- Designer
- Drawn by
- Check.by
- Copyright WUT ISE 2018.
  This documentation describes Open Hardware and is licensed under the CERN OHL v.1.1. You may redistribute and modify this documentation under the terms of the CERN OHL v.1.1. (http://ohwr.org/CERNOHL). This documentation is distributed WITHOUT ANY EXPRESS OR IMPLIED WARRANTY, INCLUDING OF MERCHANTABILITY, SATISFACTORY QUALITY AND FITNESS FOR A PARTICULAR PURPOSE. Please see the CERN OHL v.1.1 for applicable conditions.
- Contact
- File
- Last Mod.
- Print Date
- Sheet
- Size
- A3
- of
- Rev

### Library data of the parts
C52-C55 C58-C69 = CC0402_100NF_16V_10%_X7R: Non-polarised capacitor; Part Description: SMD Multilayer Chip Ceramic Capacitor; Manufacturer: GENERIC; Manufacturer1 Part Number: GRM155R71C104KA88D; Voltage: 16V; TC: X7R; Tolerance: ±10%; Table: Capacitors SMD; Part Number: CC0402_100NF_16V_10%_X7R; Component Kind: Standard; Component Type: Standard; Pin Count: 2; Value: 100nF; Status: Not Recommended; Manufacturer Part Number: CC0402_100NF_16V_10%_X7R; Case: 0402; Mounted: Yes; Socket: No; SMD: Yes; Manufacturer1 Example: MURATA; Manufacturer1 ComponentHeight: 0.55mm; HelpURL: \\cern.ch\dfs\Applications\Altium\Datasheets\CC0402_X7R_MURATA_GRM.pdf; Author: CERN DEM JLC; CreateDate: 2013-12-05; LatestRevisionDate: 2007-12-03
C56 C57 = CC1206_22UF_6.3V_20%_X5R: Non-polarised capacitor; Part Description: SMD Multilayer Chip Ceramic Capacitor; Manufacturer: GENERIC; Manufacturer1 Part Number: C1206C226K9PAC; Voltage: 6.3V; TC: X5R; Tolerance: ±20%; Table: Capacitors SMD; Part Number: CC1206_22UF_6.3V_20%_X5R; Component Kind: Standard; Component Type: Standard; Pin Count: 2; Value: 22uF; Status: Preferred; Manufacturer Part Number: CC1206_22UF_6.3V_20%_X5R; Case: 1206; Mounted: Yes; Socket: No; SMD: Yes; Manufacturer1 Example: KEMET; Manufacturer1 ComponentHeight: 1.8mm; HelpURL: \\cern.ch\dfs\Applications\Altium\Datasheets\CC1206_X5R_KEMET.pdf; Author: CERN DEM JLC; CreateDate: 2007-12-03; LatestRevisionDate: 2007-12-03
IC12-IC27 = SN74LV595APWT: 8-Bit Shift Register With 3-State Output Register; Part Description: 8-Bit Shift Register With 3-State Output Registers; Manufacturer: TEXAS INSTRUMENTS; PressFit: No; Bonding: No; Part Number: SN74LV595APWT; Component Kind: Standard; Component Type: Standard; Device: SN74LV595APWT; PackageDescription: SOP, 0.65mm Pitch; 16 Pin, 4.40mm W X 5.00mm L X 1.20mm H body, IPC Medium Density; Manufacturer Part Number: SN74LV595APWT; Pin Count: 16; Case: TSSOP16; Mounted: Yes; Socket: No; SMD: Yes; Sense: No; ComponentHeight: 1.2mm; Author: CERN DEM JLC; HelpURL: \\cern.ch\dfs\Applications\Altium\Datasheets\SN74LV595APWT.pdf; CreateDate: 10.05.2012; LatestRevisionDate: 10.05.2012
R3 = R0402_1K_1%_0.0625W_100PPM: Resistor - 1%; Part Description: General Purpose Thick Film Chip Resistor; Manufacturer: GENERIC; Manufacturer1 Part Number: 232270671002L; TC: ±100ppm/°C; PressFit: No; Part Number: R0402_1K_1%_0.0625W_100PPM; Component Kind: Standard; Component Type: Standard; Pin Count: 2; Value: 1k; Status: Not Recommended; Power: 0.0625W; Manufacturer Part Number: R0402_1K_1%_0.0625W_100PPM; Case: 0402; Mounted: Yes; Sense: No; Socket: No; SMD: Yes; Manufacturer1 Example: YAGEO PHYCOMP; Manufacturer1 ComponentHeight: 0.4mm; HelpURL: \\cern.ch\dfs\Applications\Altium\Datasheets\R0402_Phycomp_RC0402.pdf; Author: CERN DEM JLC; CreateDate: 03.12.2007; LatestRevisionDate: 17.10.2012